# Altium project Remote Project.PrjPcb
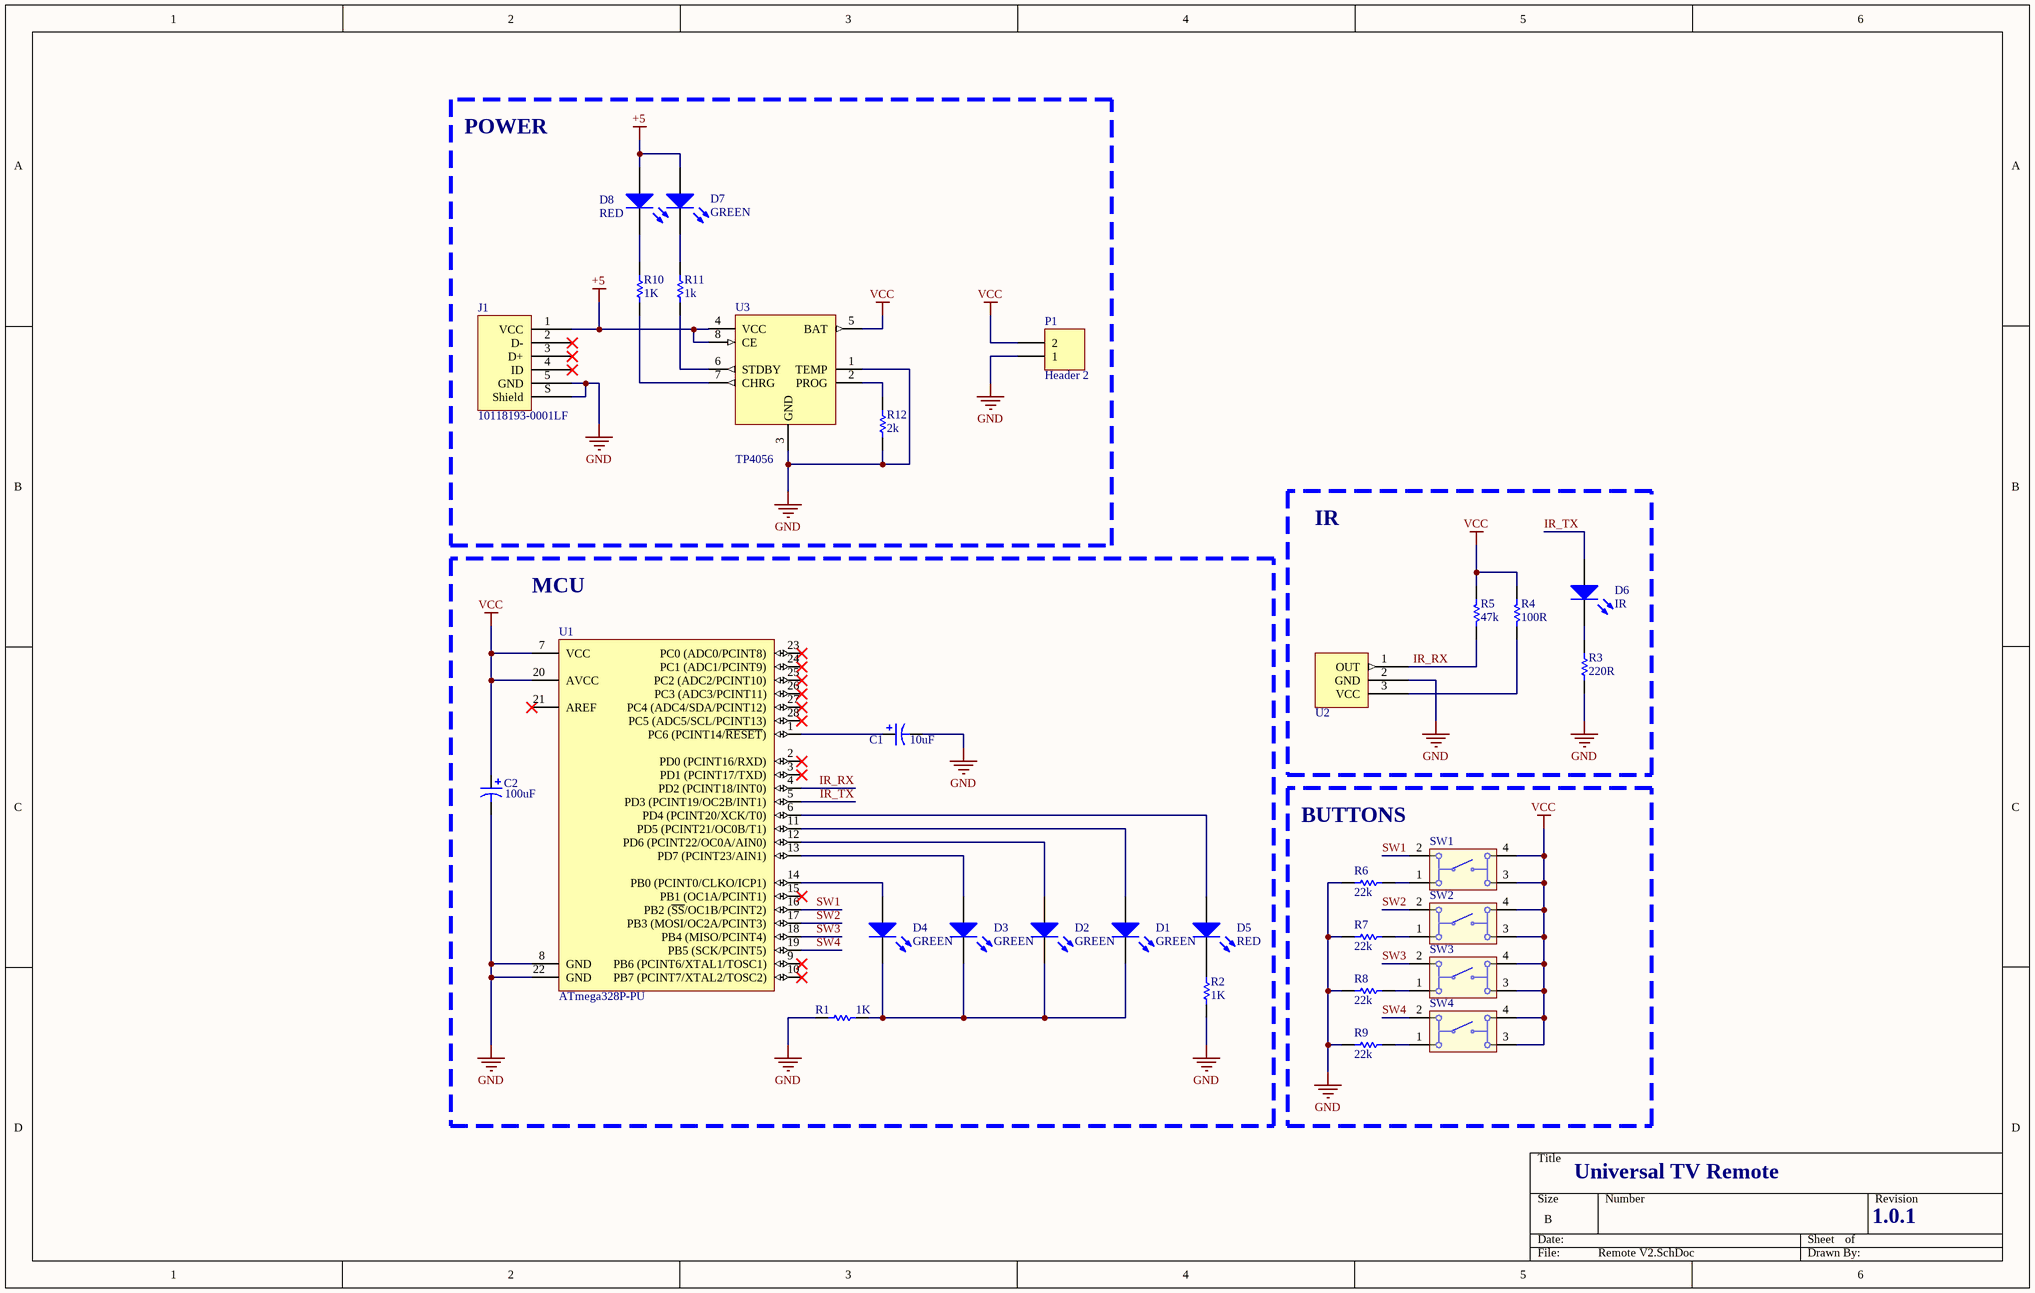
[diagram p0: Remote V2.SchDoc]
1 sheet, 31 parts. Net scope: global (net labels, ports and power ports of the same name join across sheets).
Board file: PCB1.PcbDoc

## Sheet Remote V2.SchDoc: Universal TV Remote
size B; Revision: 1.0.1

### Parts
C1  value 10uF  [5mm CAP]  (hidden comment: Cap Pol1)
C2  value 100uF  [5mm CAP]  (hidden comment: Cap Pol1)
D1  GREEN  [5mm CAP]
D2  GREEN  [5mm CAP]
D3  GREEN  [5mm CAP]
D4  GREEN  [5mm CAP]
D5  RED  [5mm CAP]
D6  IR  [5mm CAP]
D7  GREEN  [5mm CAP]
D8  RED  [5mm CAP]
J1  10118193-0001LF  [FCI USB 10118193-0001LF]
P1  Header 2  [HDR1X2]
R1  value 1K  [AXIAL-0.3]  (hidden comment: Res1)
R2  value 1K  [AXIAL-0.3]  (hidden comment: Res1)
R3  value 220R  [AXIAL-0.3]  (hidden comment: Res1)
R4  value 100R  [AXIAL-0.3]  (hidden comment: Res1)
R5  value 47k  [AXIAL-0.3]  (hidden comment: Res1)
R6  value 22k  [AXIAL-0.3]  (hidden comment: Res1)
R7  value 22k  [AXIAL-0.3]  (hidden comment: Res1)
R8  value 22k  [AXIAL-0.3]  (hidden comment: Res1)
R9  value 22k  [AXIAL-0.3]  (hidden comment: Res1)
R10  value 1K  [6-0805_N]  (hidden comment: Res1)
R11  value 1k  [6-0805_N]  (hidden comment: Res1)
R12  value 2k  [6-0805_N]  (hidden comment: Res1)
SW1  430476085716  [SW_1825910-6-4]  (value not drawn)
SW2  430476085716  [SW_1825910-6-4]  (value not drawn)
SW3  430476085716  [SW_1825910-6-4]  (value not drawn)
SW4  430476085716  [SW_1825910-6-4]  (value not drawn)
U1  ATmega328P-PU  [28P3]
U2  CHO 1838  [TO-220-AB]  (value not drawn)
U3  TP4056  [Universal SOP 8]

### Blocks framed on the sheet
POWER: D7 D8 J1 P1 R10-R12 U3
IR: D6 R3-R5 U2
MCU: C1 C2 D1-D5 R1 R2 U1
BUTTONS: R6-R9 SW1-SW4

### Nets
+5: D7.1(A) D8.1(A) J1.1(VCC) U3.4(VCC) U3.8(CE)
GND: C1.2 C2.2 J1.5(GND) J1.S(Shield) P1.1 R1.1 R2.1 R3.1 R6.1 R7.1 R8.1 R9.1 R12.1 U1.8(GND) U1.22(GND) U2.2(GND) U3.1(TEMP) U3.3(GND)
VCC: C2.1 P1.2 R4.1 R5.2 SW1.3 SW1.4 SW2.3 SW2.4 SW3.3 SW3.4 SW4.3 SW4.4 U1.7(VCC) U1.20(AVCC) U3.5(BAT)
IR_RX: R5.1 U1.4(PD2_(PCINT18/INT0)) U2.1(OUT)
IR_TX: D6.1(A) U1.5(PD3_(PCINT19/OC2B/INT1))
SW1: SW1.2 U1.16(PB2_(~{SS}/OC1B/PCINT2))
SW2: SW2.2 U1.17(PB3_(MOSI/OC2A/PCINT3))
SW3: SW3.2 U1.18(PB4_(MISO/PCINT4))
SW4: SW4.2 U1.19(PB5_(SCK/PCINT5))
NetC1_1: C1.1 U1.1(PC6_(PCINT14/~{RESET}))
NetD1_1: D1.1(A) U1.11(PD5_(PCINT21/OC0B/T1))
NetD1_2: D1.2(K) D2.2(K) D3.2(K) D4.2(K) R1.2
NetD2_1: D2.1(A) U1.12(PD6_(PCINT22/OC0A/AIN0))
NetD3_1: D3.1(A) U1.13(PD7_(PCINT23/AIN1))
NetD4_1: D4.1(A) U1.14(PB0_(PCINT0/CLKO/ICP1))
NetD5_1: D5.1(A) U1.6(PD4_(PCINT20/XCK/T0))
NetD5_2: D5.2(K) R2.2
NetD6_2: D6.2(K) R3.2
NetD7_2: D7.2(K) R11.2
NetD8_2: D8.2(K) R10.2
NetR4_2: R4.2 U2.3(VCC)
NetR6_2: R6.2 SW1.1
NetR7_2: R7.2 SW2.1
NetR8_2: R8.2 SW3.1
NetR9_2: R9.2 SW4.1
NetR10_1: R10.1 U3.7(CHRG)
NetR11_1: R11.1 U3.6(STDBY)
NetR12_2: R12.2 U3.2(PROG)

Not connected (* = marked no-connect by the designer): J1 2(D-)* 3(D+)* 4(ID)*; U1 2(PD0_(PCINT16/RXD))* 3(PD1_(PCINT17/TXD))* 9(PB6_(PCINT6/XTAL1/TOSC1))* 10(PB7_(PCINT7/XTAL2/TOSC2))* 15(PB1_(OC1A/PCINT1))* 21(AREF)* 23(PC0_(ADC0/PCINT8))* 24(PC1_(ADC1/PCINT9))* 25(PC2_(ADC2/PCINT10))* 26(PC3_(ADC3/PCINT11))* 27(PC4_(ADC4/SDA/PCINT12))* 28(PC5_(ADC5/SCL/PCINT13))*

### Notes on the sheet
- 1.0.1

### Library data of the parts
C1 C2 = Cap Pol1: Polarized Capacitor (Radial); Published: 8-Jun-2000; LatestRevisionDate: 17-Jul-2002; LatestRevisionNote: Re-released for DXP Platform.; PackageReference: RB7.6-15; Publisher: Altium Limited; PackageDescription: Polarized Capacitor (Radial); 2 Leads
D1-D8 = LED0: Typical INFRARED GaAs LED; Published: 8-Jun-2000; LatestRevisionDate: 08-Jul-2005; LatestRevisionNote: Mech Layer 1 removed.; PackageReference: LED-0; Publisher: Altium Limited; PackageDescription: LED; 2 Leads
J1 = 10118193-0001LF: CONN RCPT USB2.0 MICRO B SMD R/A; Manufacturer: Amphenol ICC (FCI); Connector Type: USB - micro B; Current Rating (Amps): 1.8A per Contact; Gender: Receptacle; Mating Cycles: 10000; Number of Contacts: 5; Number of Ports: 1; Shielding: Shielded; Voltage - Rated: 100VAC; Part Number: 10118193-0001LF; ComponentLink1Description: Datasheet; ComponentLink1URL: https://cdn.amphenol-icc.com/media/wysiwyg/files/documentation/datasheet/inputoutput/io_usb_micro.pdf; ComponentLink2Description: DigiKey Link; ComponentLink2URL: //digikey.com/product-detail/en/amphenol-icc-fci/10118193-0001LF/609-4616-2-ND/2785388; Features: Solder Retention; LastUpdated: 12/9/2019 8:51:28 PM; Lifecycle Status: 0; Minimum Order: 1; Mounting Feature: Horizontal; Mounting Type: Surface Mount, Right Angle; Through Hole; Operating Temperature: -30°C ~ 80°C; Packaging: TapeAndReel; Part Status: Active; Price: 0.21; Series: -; Specifications: USB 2.0; Supplier 1: DigiKey; Supplier Part Number 1: 609-4616-2-ND; Termination: Solder
P1 = Header 2: Header, 2-Pin; LatestRevisionDate: 17-Jul-2002; LatestRevisionNote: Re-released for DXP Platform.; Publisher: Altium Limited
R1-R12 = Res1: Resistor; Published: 8-Jun-2000; LatestRevisionDate: 17-Jul-2002; LatestRevisionNote: Re-released for DXP Platform.; PackageReference: AXIAL-0.3; Publisher: Altium Limited; PackageDescription: Axial Device, Thru-Hole; 2 Leads; 0.3 in Pin Spacing
SW1-SW4 = 430476085716: WS-TATV THT Tact Switch 12X12 mm; NoPins: 04; PackageReference: 430476085716; PartNumber: 430476085716; ComponentLink1Description: Manufacturer URL; ComponentLink1URL: http://www.we-online.com; ComponentLink2Description: Datasheet; ComponentLink2URL: http://katalog.we-online.de/em/datasheet/430476085716.pdf
U1 = ATmega328P-PU: 8-bit AVR Microcontroller, 32KB Flash, 1KB EEPROM, 2KB SRAM, 28-pin PDIP, Industrial Grade (-40°C to 85°C); DatasheetVersion: revD, May-2011; PackageVersion: revB, Sep-2001; PackageReference: 28P3; PackageDescription: 28-lead (0.300"/7.62mm Wide) Plastic Dual Inline Package (PDIP); ComponentLink1Description: Manufacturer URL; ComponentLink1URL: http://www.atmel.com/; ComponentLink2Description: ATmega48A/48PA/88A/88PA/168A/168PA/328/328P Datasheet; ComponentLink2URL: http://www.atmel.com/dyn/resources/prod_documents/8271.pdf; ComponentLink3Description: ATmega48A/48PA/88A/88PA/168A/168PA/328/328P Summary; ComponentLink3URL: http://www.atmel.com/dyn/resources/prod_documents/8271S.pdf
U2 = CHO 1838: IR Receiver